# Altium schematic sheet 3PhaseMotorDriver.SchDoc
size A1
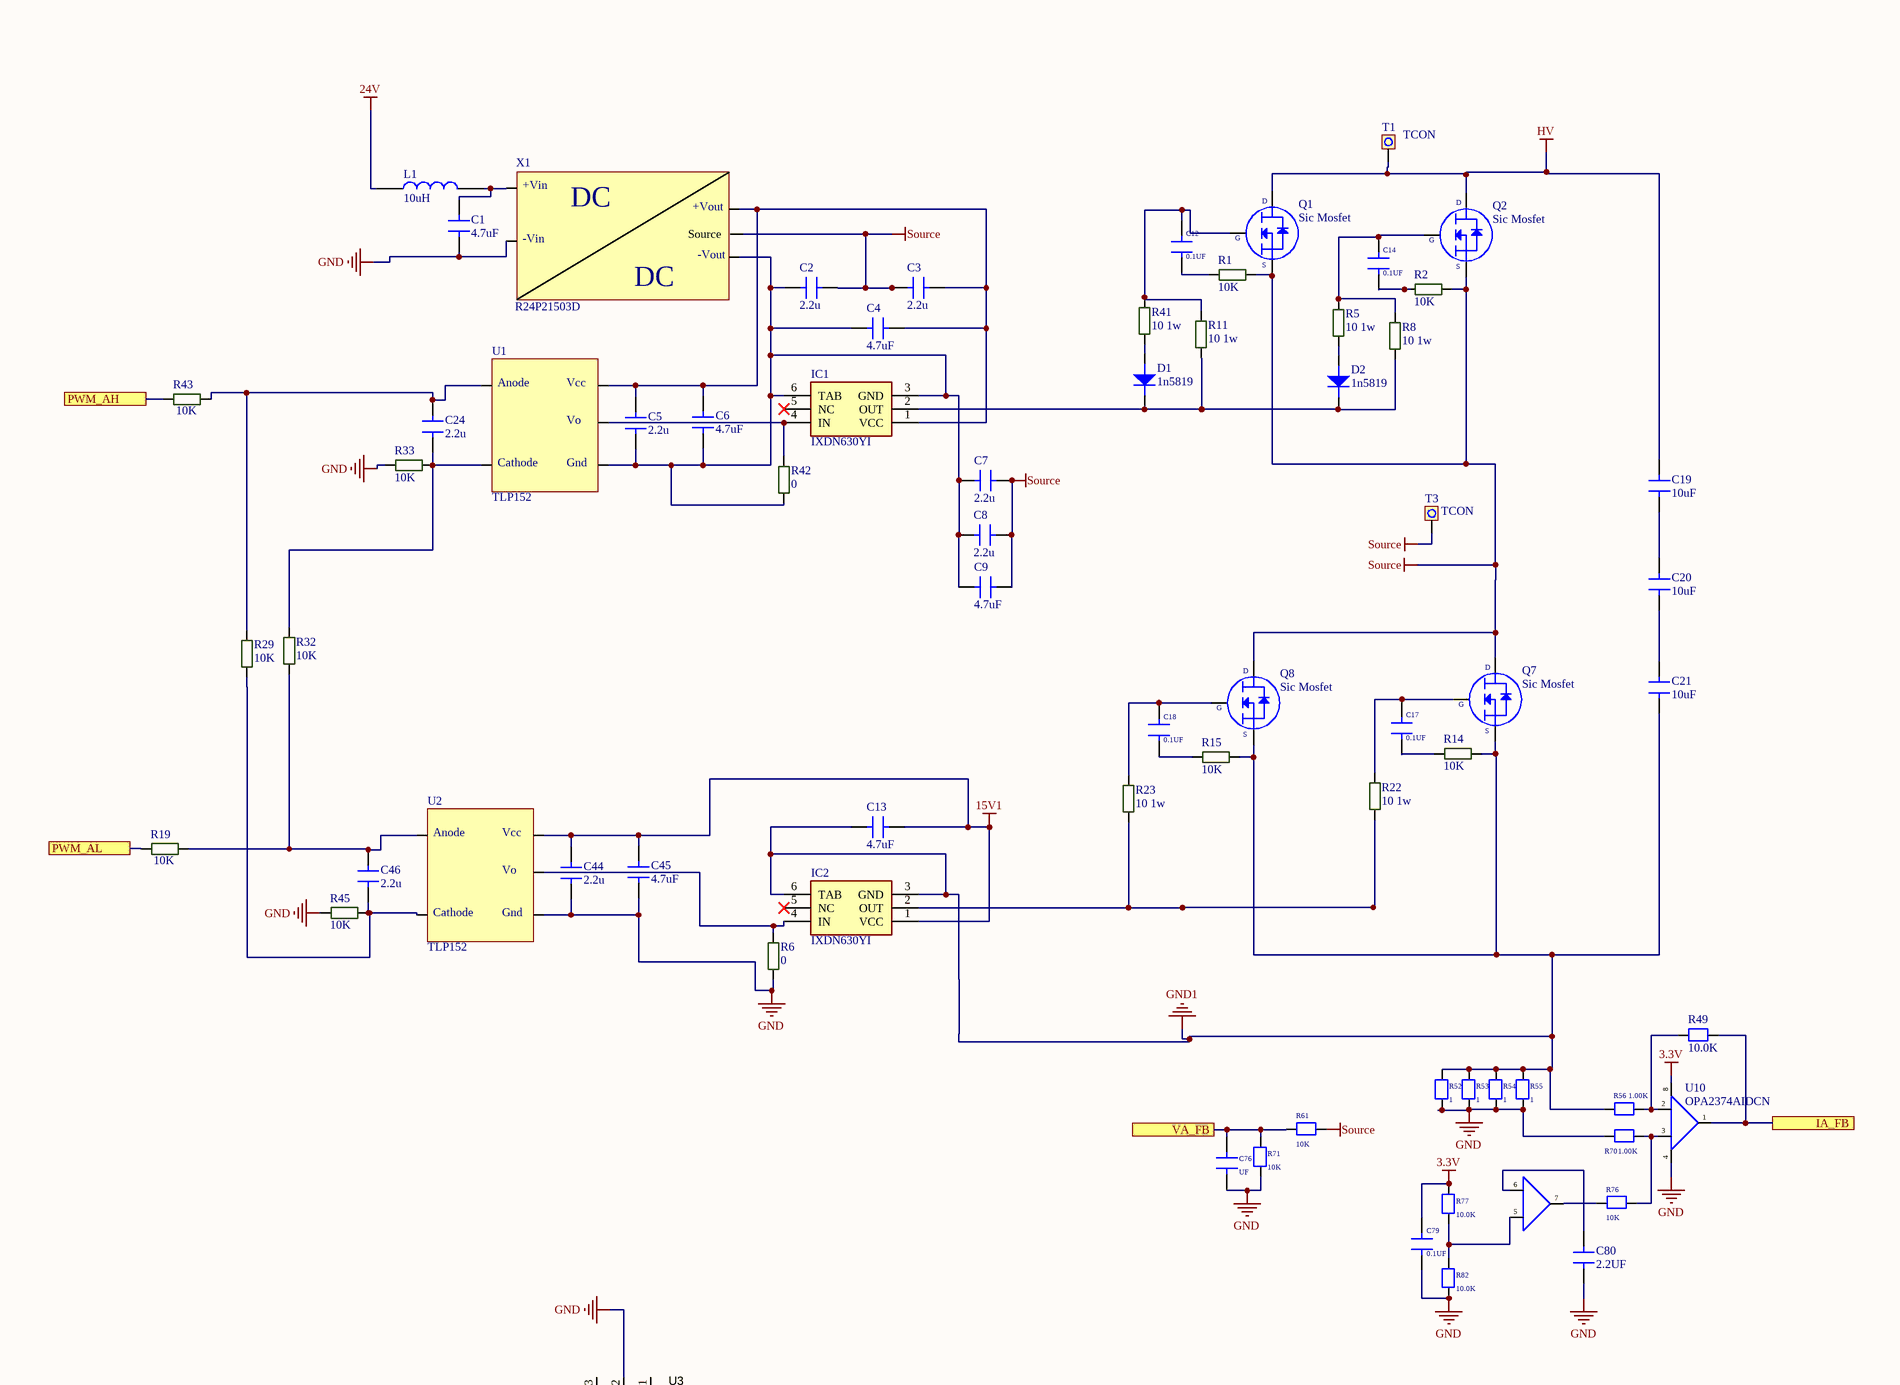
[diagram p0: 3PhaseMotorDriver.SchDoc, top left]
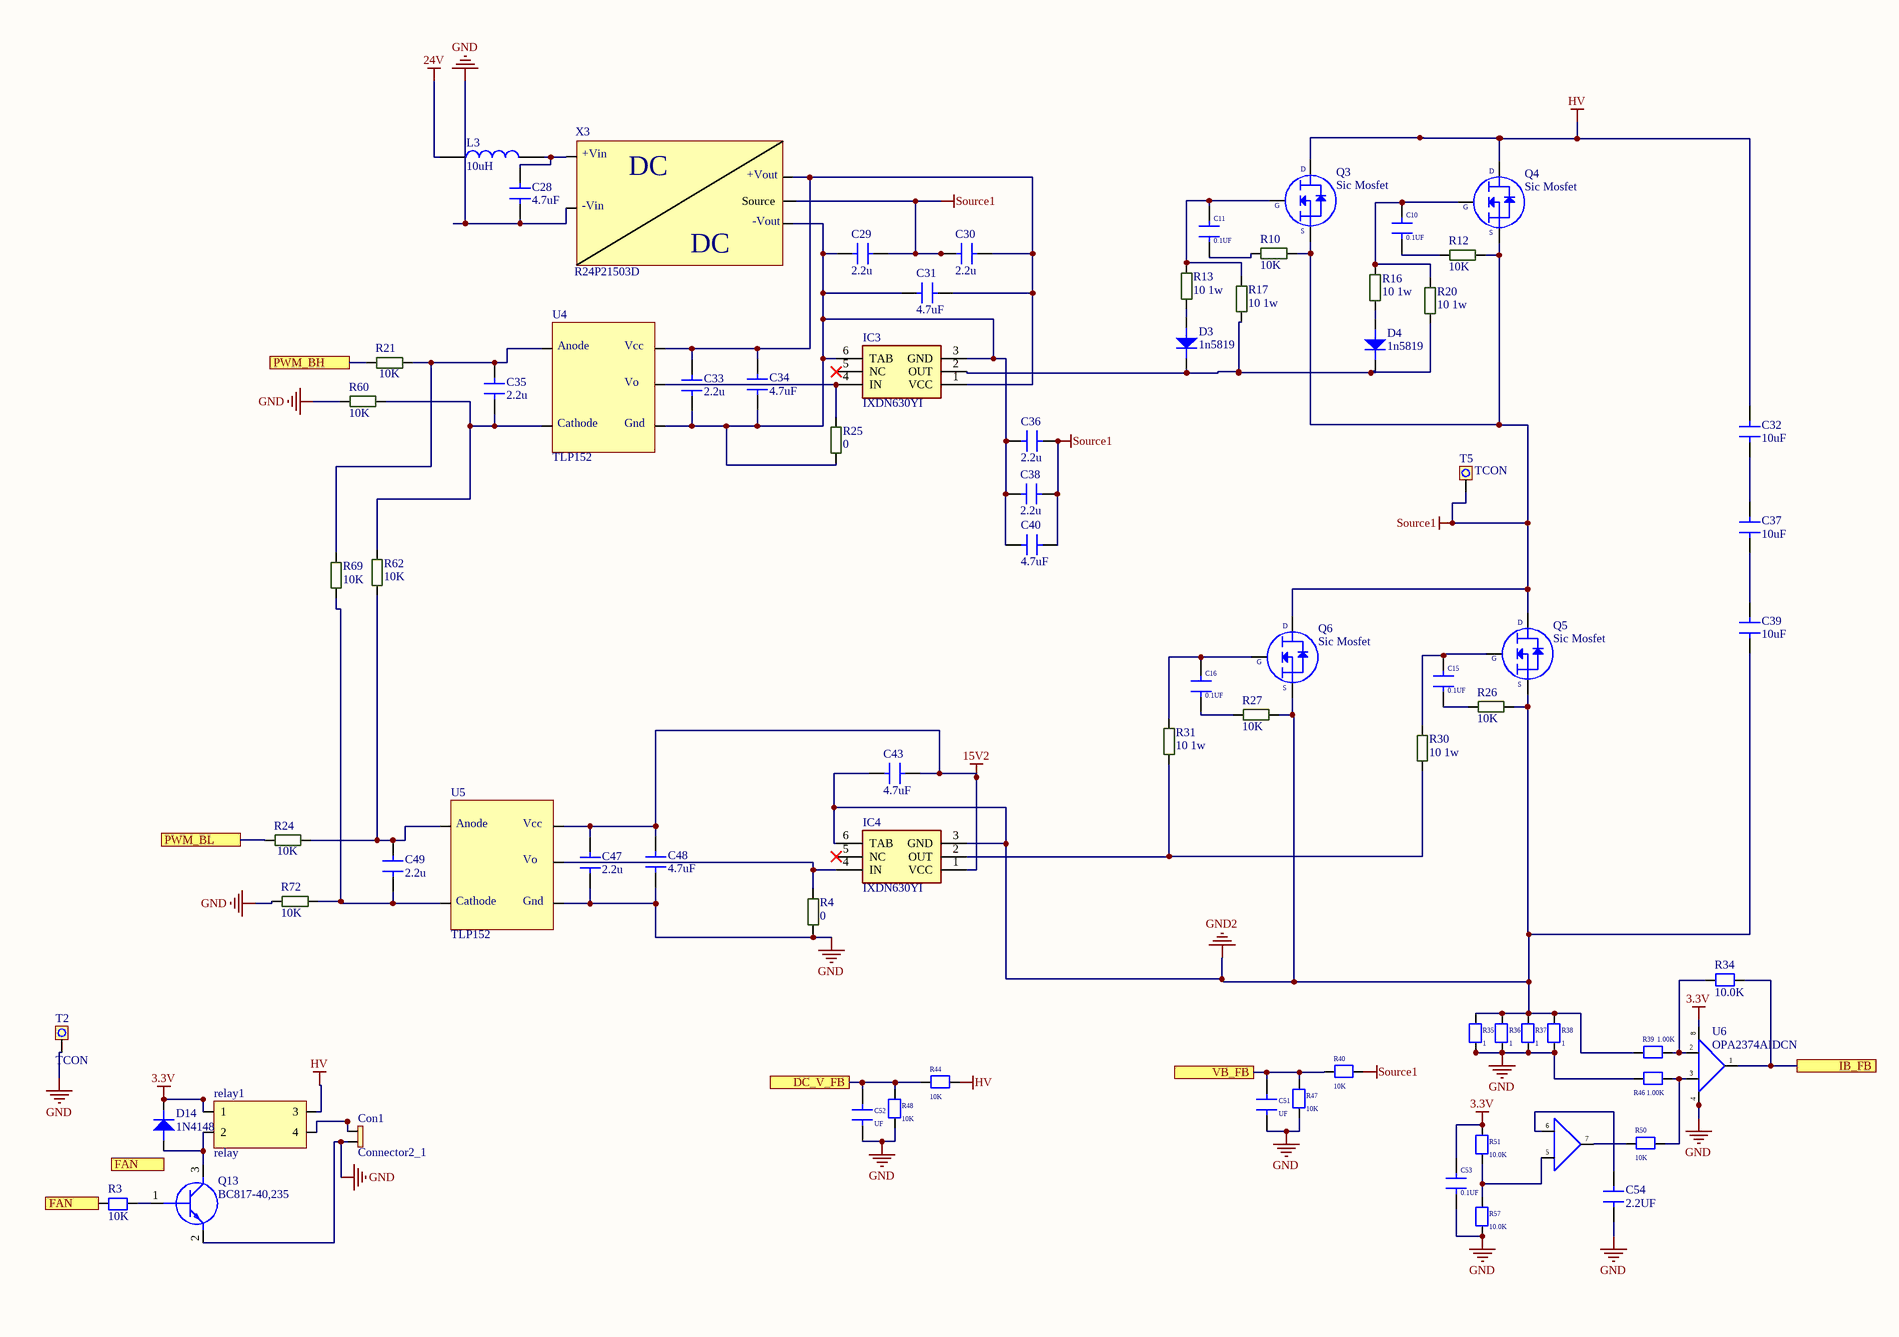
[diagram p1: 3PhaseMotorDriver.SchDoc, top middle]
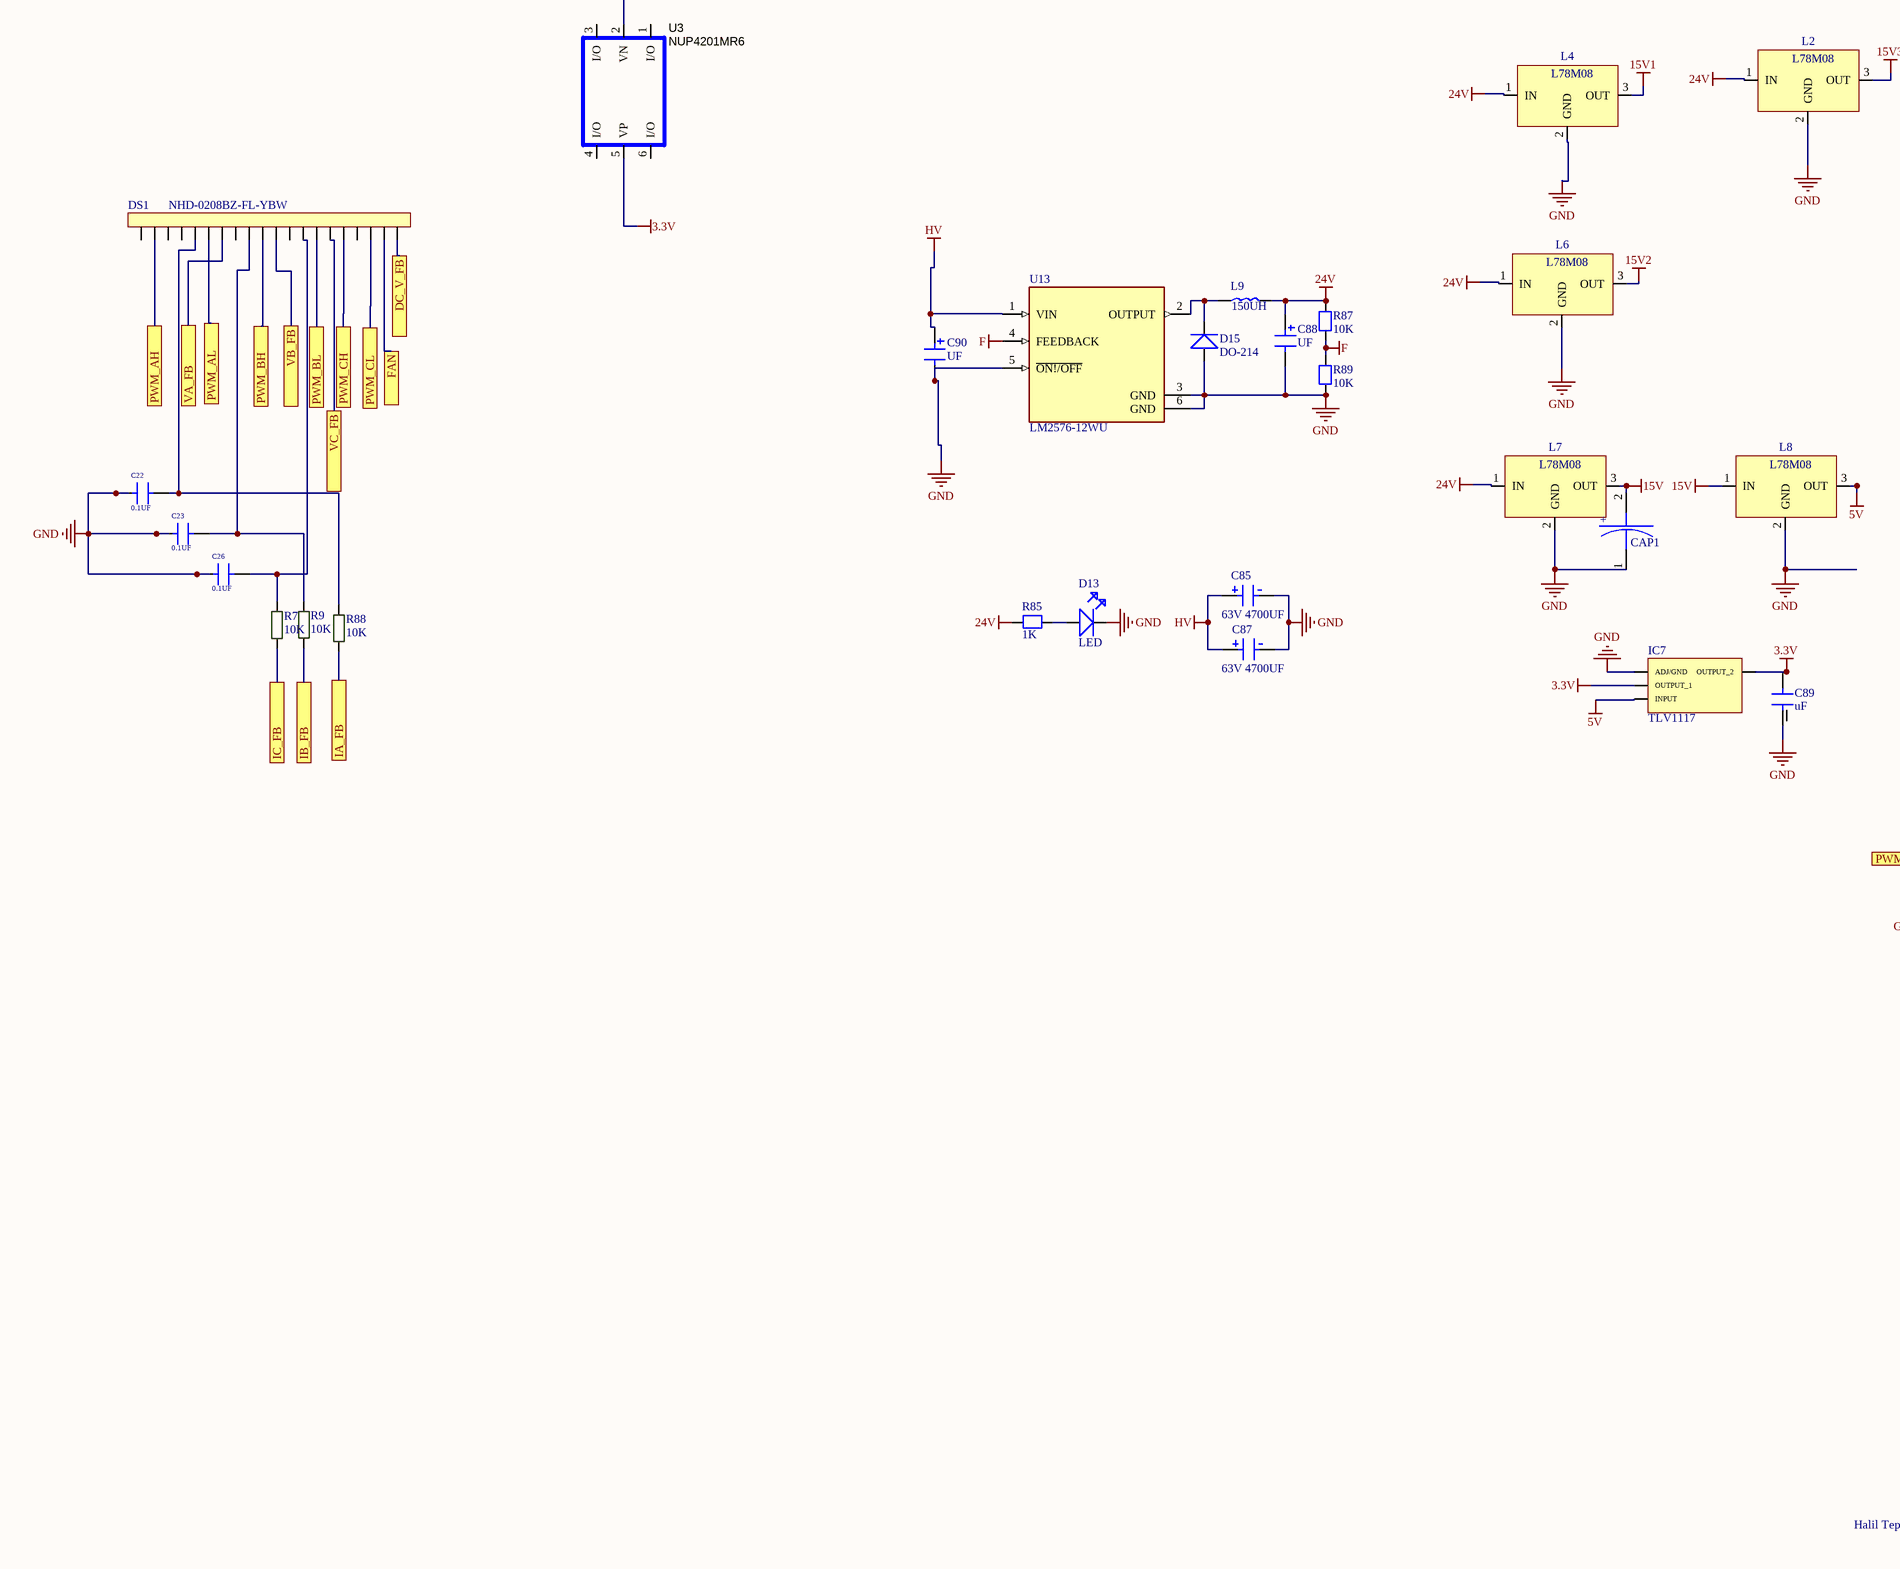
[diagram p2: 3PhaseMotorDriver.SchDoc, bottom left]
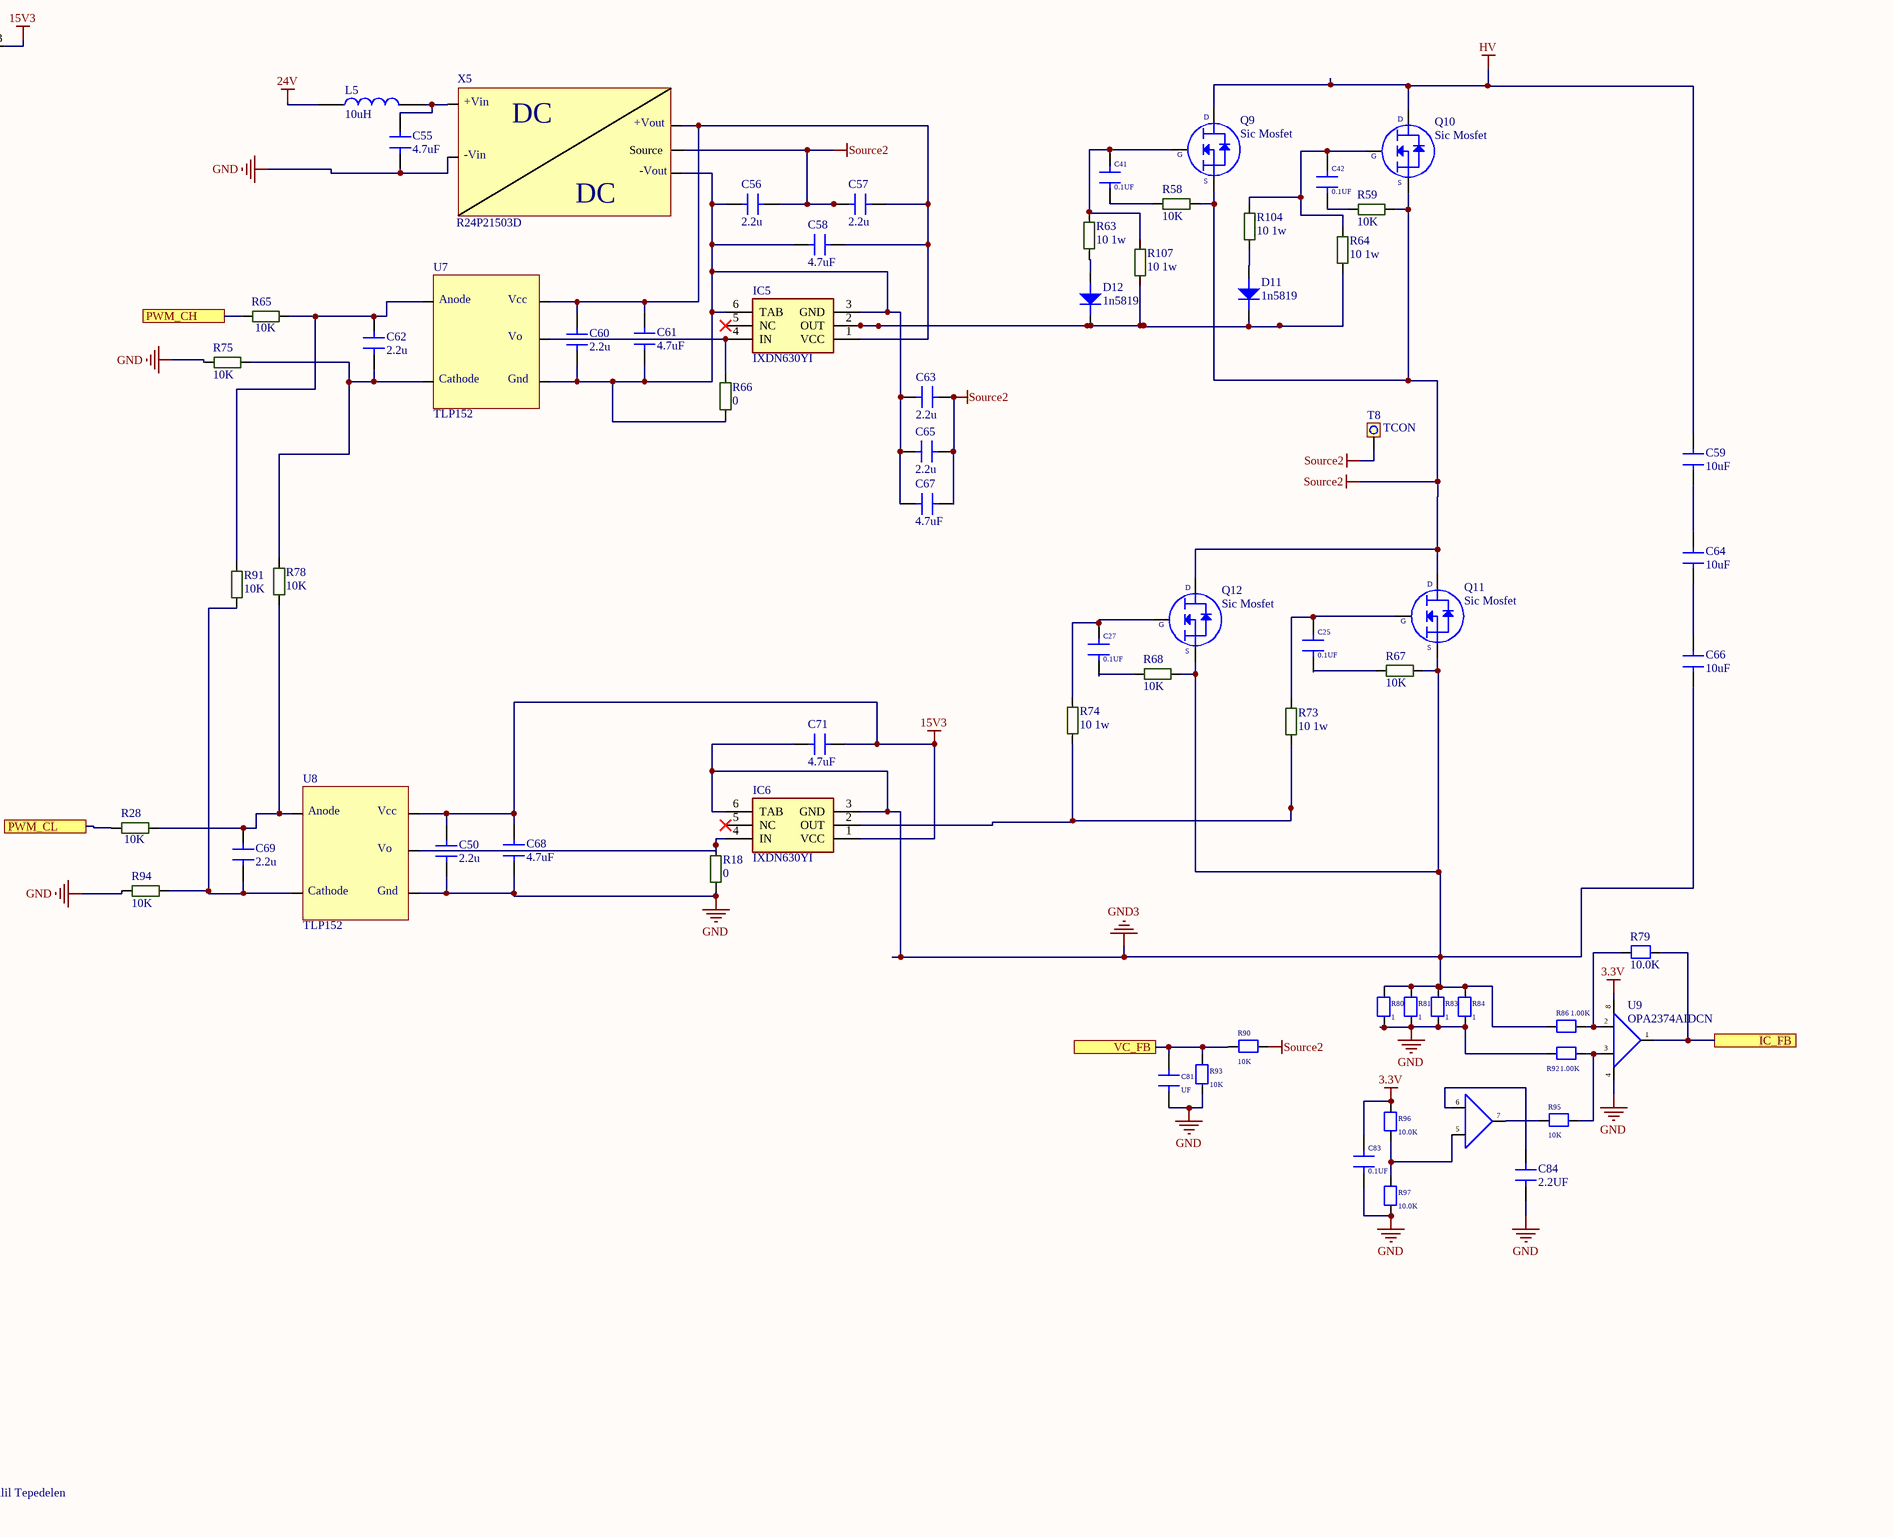
[diagram p3: 3PhaseMotorDriver.SchDoc, bottom middle]
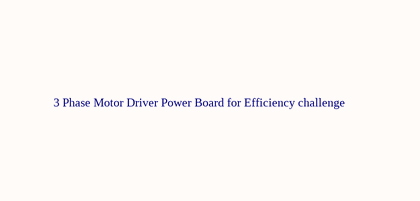
[diagram p4: 3PhaseMotorDriver.SchDoc, bottom right]

## Parts
C1  4.7uF  [C-1206]
C2  2.2u  [C-0805]
C3  2.2u  [C-0805]
C4  4.7uF  [C-1206]
C5  2.2u  [C-0805]
C6  4.7uF  [C-1206]
C7  2.2u  [C-0805]
C8  2.2u  [C-0805]
C9  4.7uF  [C-1206]
C10  0.1UF  [C-0603W]
C11  0.1UF  [C-0603W]
C12  0.1UF  [C-0603W]
C13  4.7uF  [C-1206]
C14  0.1UF  [C-0603W]
C15  0.1UF  [C-0603W]
C16  0.1UF  [C-0603W]
C17  0.1UF  [C-0603W]
C18  0.1UF  [C-0603W]
C19  10uF  [C-2220R]
C20  10uF  [C-2220R]
C21  10uF  [C-2220R]
C22  0.1UF  [C-0603W]
C23  0.1UF  [C-0603W]
C24  2.2u  [C-0805]
C25  0.1UF  [C-0603W]
C26  0.1UF  [C-0603W]
C27  0.1UF  [C-0603W]
C28  4.7uF  [C-1206]
C29  2.2u  [C-0805]
C30  2.2u  [C-0805]
C31  4.7uF  [C-1206]
C32  10uF  [C-2220R]
C33  2.2u  [C-0805]
C34  4.7uF  [C-1206]
C35  2.2u  [C-0805]
C36  2.2u  [C-0805]
C37  10uF  [C-2220R]
C38  2.2u  [C-0805]
C39  10uF  [C-2220R]
C40  4.7uF  [C-1206]
C41  0.1UF  [C-0603W]
C42  0.1UF  [C-0603W]
C43  4.7uF  [C-1206]
C44  2.2u  [C-0805]
C45  4.7uF  [C-1206]
C46  2.2u  [C-0805]
C47  2.2u  [C-0805]
C48  4.7uF  [C-1206]
C49  2.2u  [C-0805]
C50  2.2u  [C-0805]
C51  UF  [C-1206W]
C52  UF  [C-1206W]
C53  0.1UF  [C-0603W]
C54  2.2UF  [C-0603W]
C55  4.7uF  [C-1206]
C56  2.2u  [C-0805]
C57  2.2u  [C-0805]
C58  4.7uF  [C-1206]
C59  10uF  [C-2220R]
C60  2.2u  [C-0805]
C61  4.7uF  [C-1206]
C62  2.2u  [C-0805]
C63  2.2u  [C-0805]
C64  10uF  [C-2220R]
C65  2.2u  [C-0805]
C66  10uF  [C-2220R]
C67  4.7uF  [C-1206]
C68  4.7uF  [C-1206]
C69  2.2u  [C-0805]
C71  4.7uF  [C-1206]
C76  UF  [C-1206W]
C79  0.1UF  [C-0603W]
C80  2.2UF  [C-0603W]
C81  UF  [C-1206W]
C83  0.1UF  [C-0603W]
C84  2.2UF  [C-0603W]
C85  63V 4700UF  [Koshin 63v 4700 cap]
C87  63V 4700UF  [Koshin 63v 4700 cap]
C88  UF  [CapSmdElc]
C89  uF  [CapSmdElc]
C90  UF  [CapSmdElc]
CAP1  VZH100M1HTR-0606  [EEH-ZA1E101XP]  (value not drawn)
Con1  Connector2_1  [2pinCon]
D1  1n5819  [SOD123]
D2  1n5819  [SOD123]
D3  1n5819  [SOD123]
D4  1n5819  [SOD123]
D11  1n5819  [SOD123]
D12  1n5819  [SOD123]
D13  LED  [3.5X2.8X1.9 LED SMD]
D14  1N4148  [SOD123]
D15  DO-214  [DO-214AC]
DS1  NHD-0208BZ-FL-YBW  [idc20]
IC1  IXDN630YI  [5-LEAD_TO-263]
IC2  IXDN630YI  [5-LEAD_TO-263]
IC3  IXDN630YI  [5-LEAD_TO-263]
IC4  IXDN630YI  [5-LEAD_TO-263]
IC5  IXDN630YI  [5-LEAD_TO-263]
IC6  IXDN630YI  [5-LEAD_TO-263]
IC7  TLV1117  [TLV1117]
L1  10uH  [WE-TPC_282892]
L2  l78M08  [L7805]  (value not drawn)
L3  10uH  [WE-TPC_282892]
L4  l78M08  [L7805]  (value not drawn)
L5  10uH  [WE-TPC_282892]
L6  l78M08  [L7805]  (value not drawn)
L7  l78M08  [L7805]  (value not drawn)
L8  l78M08  [L7805]  (value not drawn)
L9  150UH  [IND_B1047AS-151M=P3]
Q1  Sic Mosfet  [247]
Q2  Sic Mosfet  [247]
Q3  Sic Mosfet  [247]
Q4  Sic Mosfet  [247]
Q5  Sic Mosfet  [247]
Q6  Sic Mosfet  [247]
Q7  Sic Mosfet  [247]
Q8  Sic Mosfet  [247]
Q9  Sic Mosfet  [247]
Q10  Sic Mosfet  [247]
Q11  Sic Mosfet  [247]
Q12  Sic Mosfet  [247]
Q13  BC817-40,235  [SOT95P230X110-3N]
R1  10K  [R-1206]
R2  10K  [R-1206]
R3  10K  [R-1206]
R4  0  [R-0805]
R5  10 1w  [R-2512W]
R6  0  [R-0805]
R7  10K  [R-1206]
R8  10 1w  [R-2512W]
R9  10K  [R-1206]
R10  10K  [R-1206]
R11  10 1w  [R-2512W]
R12  10K  [R-1206]
R13  10 1w  [R-2512W]
R14  10K  [R-1206]
R15  10K  [R-1206]
R16  10 1w  [R-2512W]
R17  10 1w  [R-2512W]
R18  0  [R-0805]
R19  10K  [R-1206]
R20  10 1w  [R-2512W]
R21  10K  [R-1206]
R22  10 1w  [R-2512W]
R23  10 1w  [R-2512W]
R24  10K  [R-1206]
R25  0  [R-0805]
R26  10K  [R-1206]
R27  10K  [R-1206]
R28  10K  [R-1206]
R29  10K  [R-1206]
R30  10 1w  [R-2512W]
R31  10 1w  [R-2512W]
R32  10K  [R-1206]
R33  10K  [R-1206]
R34  10.0K  [R-0603W]
R35  1  [R-2512W]
R36  1  [R-2512W]
R37  1  [R-2512W]
R38  1  [R-2512W]
R39  1.00K  [R-0603W]
R40  10K  [R-1206]
R41  10 1w  [R-2512W]
R42  0  [R-0805]
R43  10K  [R-1206]
R44  10K  [R-1206]
R45  10K  [R-1206]
R46  1.00K  [R-0603W]
R47  10K  [R-1206]
R48  10K  [R-1206]
R49  10.0K  [R-0603W]
R50  10K  [R-0603W]
R51  10.0K  [R-0603W]
R52  1  [R-2512W]
R53  1  [R-2512W]
R54  1  [R-2512W]
R55  1  [R-2512W]
R56  1.00K  [R-0603W]
R57  10.0K  [R-0603W]
R58  10K  [R-1206]
R59  10K  [R-1206]
R60  10K  [R-1206]
R61  10K  [R-1206]
R62  10K  [R-1206]
R63  10 1w  [R-2512W]
R64  10 1w  [R-2512W]
R65  10K  [R-1206]
R66  0  [R-0805]
R67  10K  [R-1206]
R68  10K  [R-1206]
R69  10K  [R-1206]
R70  1.00K  [R-0603W]
R71  10K  [R-1206]
R72  10K  [R-1206]
R73  10 1w  [R-2512W]
R74  10 1w  [R-2512W]
R75  10K  [R-1206]
R76  10K  [R-0603W]
R77  10.0K  [R-0603W]
R78  10K  [R-1206]
R79  10.0K  [R-0603W]
R80  1  [R-2512W]
R81  1  [R-2512W]
R82  10.0K  [R-0603W]
R83  1  [R-2512W]
R84  1  [R-2512W]
R85  1K  [14-1210]
R86  1.00K  [R-0603W]
R87  10K  [R-1206]
R88  10K  [R-1206]
R89  10K  [R-1206]
R90  10K  [R-1206]
R91  10K  [R-1206]
R92  1.00K  [R-0603W]
R93  10K  [R-1206]
R94  10K  [R-1206]
R95  10K  [R-0603W]
R96  10.0K  [R-0603W]
R97  10.0K  [R-0603W]
R104  10 1w  [R-2512W]
R107  10 1w  [R-2512W]
relay1  relay  [Relay]
T1  TCON  [tCon]
T2  TCON  [tCon]
T3  TCON  [tCon]
T5  TCON  [tCon]
T8  TCON  [tCon]
U1  TLP152  [TLP152]
U2  TLP152  [TLP152]
U3  NUP4201MR6  [SOT23-6]
U4  TLP152  [TLP152]
U5  TLP152  [TLP152]
U6  OPA2374AIDCN  [FAN3122 Soic8 - duplicate]
U7  TLP152  [TLP152]
U8  TLP152  [TLP152]
U9  OPA2374AIDCN  [FAN3122 Soic8 - duplicate]
U10  OPA2374AIDCN  [FAN3122 Soic8 - duplicate]
U13  LM2576-12WU  [TO17P1435X465-6N]
X1  R24P21503D  [SIP7]
X3  R24P21503D  [SIP7]
X5  R24P21503D  [SIP7]

## Ports
DC_V_FB, FAN, IA_FB, IB_FB, IC_FB, PWM_AH, PWM_AL, PWM_BH, PWM_BL, PWM_CH, PWM_CL, VA_FB, VB_FB, VC_FB

## Nets
3.3V: C53.2 C79.2 C83.2 C89.1 D14.k IC7.2(OUTPUT_1) R51.2 R77.2 R96.2 relay1.1 U3.5(VP) U6.8 U9.8 U10.8
5V: IC7.3(INPUT) L8.3(OUT)
15V: CAP1.2(+) L7.3(OUT) L8.1(IN)
15V1: C13.2 C44.2 C45.2 IC2.1(VCC) L4.3(OUT) U2.5
15V2: C43.2 C47.2 C48.2 IC4.1(VCC) L6.3(OUT) U5.5
15V3: C50.2 C68.2 C71.2 IC6.1(VCC) L2.3(OUT) U8.5
24V: C88.1 L1.1 L2.1(IN) L3.1 L4.1(IN) L5.1 L6.1(IN) L7.1(IN) L9.2 R85.1 R87.2
F: R87.1 R89.2 U13.4(FEEDBACK)
GND: C1.1 C22.1 C23.1 C26.1 C28.1 C44.1 C45.1 C47.1 C48.1 C50.1 C51.1 C52.1 C53.1 C54.1 C55.1 C68.1 C76.1 C79.1 C80.1 C81.1 C83.1 C84.1 C85.2 C87.2 C88.2 C89.2 C90.2 CAP1.1 Con1.2 D13.2 D15.a IC7.1(ADJ/GND) L2.2(GND) L4.2(GND) L6.2(GND) L7.2(GND) L8.2(GND) Q13.2(E) R4.1 R6.1 R18.1 R33.1 R35.1 R36.1 R37.1 R38.1 R45.1 R46.1 R47.1 R48.1 R52.1 R53.1 R54.1 R55.1 R57.1 R60.1 R70.1 R71.1 R72.1 R75.1 R80.1 R81.1 R82.1 R83.1 R84.1 R89.1 R92.1 R93.1 R94.1 R97.1 T2.1 U2.3 U3.2(VN) U5.3 U6.4 U8.3 U9.4 U10.4 U13.3(GND) U13.5(~{ON!/OFF}) U13.6(GND) X1.2 X3.2 X5.2
GND1: C13.1 C21.1 IC2.3(GND) IC2.6(TAB) Q7.3 Q8.3 R14.2 R15.2 R52.2 R53.2 R54.2 R55.2 R56.1
GND2: C39.1 C43.1 IC4.3(GND) IC4.6(TAB) Q5.3 Q6.3 R26.2 R27.2 R35.2 R36.2 R37.2 R38.2 R39.1
GND3: C66.1 C71.1 IC6.3(GND) IC6.6(TAB) Q11.3 Q12.3 R67.2 R68.2 R80.2 R81.2 R83.2 R84.2 R86.1
HV: C19.2 C32.2 C59.2 C85.1 C87.1 C90.1 Q1.2 Q2.2 Q3.2 Q4.2 Q9.2 Q10.2 R44.2 relay1.3 T1.1 U13.1(VIN)
Source: C2.1 C3.2 C7.2 C8.2 C9.2 Q1.3 Q2.3 Q7.2 Q8.2 R1.2 R2.2 R61.2 T3.1 X1.6(Source)
Source1: C29.1 C30.2 C36.2 C38.2 C40.2 Q3.3 Q4.3 Q5.2 Q6.2 R10.2 R12.2 R40.2 T5.1 X3.6(Source)
Source2: C56.1 C57.2 C63.2 C65.2 C67.2 Q9.3 Q10.3 Q11.2 Q12.2 R58.2 R59.2 R90.2 T8.1 X5.6(Source)
DC_V_FB: C52.2 DS1.20 R44.1 R48.2 ; port DC_V_FB
FAN: DS1.19 R3.2 ; port FAN
IA_FB: R49.2 R88.1 U10.1 ; port IA_FB
IB_FB: R9.1 R34.2 U6.1 ; port IB_FB
IC_FB: R7.1 R79.2 U9.1 ; port IC_FB
PWM_AH: DS1.2 R43.2 ; port PWM_AH
PWM_AL: DS1.6 R19.2 ; port PWM_AL
PWM_BH: DS1.10 R21.2 ; port PWM_BH
PWM_BL: DS1.14 R24.2 ; port PWM_BL
PWM_CH: DS1.16 R65.2 ; port PWM_CH
PWM_CL: DS1.18 R28.2 ; port PWM_CL
VA_FB: C76.2 DS1.7 R61.1 R71.2 ; port VA_FB
VB_FB: C51.2 DS1.11 R40.1 R47.2 ; port VB_FB
VC_FB: C81.2 DS1.15 R90.1 R93.2 ; port VC_FB
NetC1_2: C1.2 L1.2 X1.1
NetC2_2: C2.2 C4.1 C5.1 C6.1 C7.1 C8.1 C9.1 IC1.3(GND) IC1.6(TAB) R42.1 U1.3 X1.5
NetC3_1: C3.1 C4.2 C5.2 C6.2 IC1.1(VCC) U1.5 X1.7
NetC10_1: C10.1 R12.1
NetC10_2: C10.2 Q4.1 R16.1 R20.2
NetC11_1: C11.1 R10.1
NetC11_2: C11.2 Q3.1 R13.1 R17.2
NetC12_1: C12.1 R1.1
NetC12_2: C12.2 Q1.1 R11.2 R41.1
NetC14_1: C14.1 R2.1
NetC14_2: C14.2 Q2.1 R5.1 R8.2
NetC15_1: C15.1 R26.1
NetC15_2: C15.2 Q5.1 R30.2
NetC16_1: C16.1 R27.1
NetC16_2: C16.2 Q6.1 R31.2
NetC17_1: C17.1 R14.1
NetC17_2: C17.2 Q7.1 R22.2
NetC18_1: C18.1 R15.1
NetC18_2: C18.2 Q8.1 R23.2
NetC19_1: C19.1 C20.2
NetC20_1: C20.1 C21.2
NetC22_2: C22.2 DS1.5 R88.2
NetC23_2: C23.2 DS1.9 R9.2
NetC24_1: C24.1 R32.1 R33.2 U1.2
NetC24_2: C24.2 R29.1 R43.1 U1.1
NetC25_1: C25.1 R67.1
NetC25_2: C25.2 Q11.1 R73.2
NetC26_2: C26.2 DS1.13 R7.2
NetC27_1: C27.1 R68.1
NetC27_2: C27.2 Q12.1 R74.2
NetC28_2: C28.2 L3.2 X3.1
NetC29_2: C29.2 C31.1 C33.1 C34.1 C36.1 C38.1 C40.1 IC3.3(GND) IC3.6(TAB) R25.1 U4.3 X3.5
NetC30_1: C30.1 C31.2 C33.2 C34.2 IC3.1(VCC) U4.5 X3.7
NetC32_1: C32.1 C37.2
NetC35_1: C35.1 R60.2 R62.1 U4.2
NetC35_2: C35.2 R21.1 R69.1 U4.1
NetC37_1: C37.1 C39.2
NetC41_1: C41.1 R58.1
NetC41_2: C41.2 Q9.1 R63.2 R107.1
NetC42_1: C42.1 R59.1
NetC42_2: C42.2 Q10.1 R64.2 R104.2
NetC46_1: C46.1 R29.2 R45.2 U2.2
NetC46_2: C46.2 R19.1 R32.2 U2.1
NetC49_1: C49.1 R69.2 R72.2 U5.2
NetC49_2: C49.2 R24.1 R62.2 U5.1
NetC54_2: C54.2 U6.6
NetC55_2: C55.2 L5.2 X5.1
NetC56_2: C56.2 C58.1 C60.1 C61.1 C63.1 C65.1 C67.1 IC5.3(GND) IC5.6(TAB) R66.1 U7.3 X5.5
NetC57_1: C57.1 C58.2 C60.2 C61.2 IC5.1(VCC) U7.5 X5.7
NetC59_1: C59.1 C64.2
NetC62_1: C62.1 R75.2 R78.1 U7.2
NetC62_2: C62.2 R65.1 R91.1 U7.1
NetC64_1: C64.1 C66.2
NetC69_1: C69.1 R91.2 R94.2 U8.2
NetC69_2: C69.2 R28.1 R78.2 U8.1
NetC80_2: C80.2 U10.6
NetC84_2: C84.2 U9.6
NetCon1_1: Con1.1 relay1.4
NetD1_a: D1.a R41.2
NetD1_k: D1.k D2.k IC1.2(OUT) R8.1 R11.1
NetD2_a: D2.a R5.2
NetD3_a: D3.a R13.2
NetD3_k: D3.k D4.k IC3.2(OUT) R17.1 R20.1
NetD4_a: D4.a R16.2
NetD11_a: D11.a R104.1
NetD11_k: D11.k D12.k IC5.2(OUT) R64.1 R107.2
NetD12_a: D12.a R63.1
NetD13_1: D13.1 R85.2
NetD14_a: D14.a Q13.3(C) relay1.2
NetD15_k: D15.k L9.1 U13.2(OUTPUT)
NetIC1_4: IC1.4(IN) R42.2 U1.4
NetIC2_2: IC2.2(OUT) R22.1 R23.1
NetIC2_4: IC2.4(IN) R6.2 U2.4
NetIC3_4: IC3.4(IN) R25.2 U4.4
NetIC4_2: IC4.2(OUT) R30.1 R31.1
NetIC4_4: IC4.4(IN) R4.2 U5.4
NetIC5_4: IC5.4(IN) R66.2 U7.4
NetIC6_2: IC6.2(OUT) R73.1 R74.1
NetIC6_4: IC6.4(IN) R18.2 U8.4
NetQ13_1: Q13.1(B) R3.1
NetR34_1: R34.1 R39.2 U6.2
NetR46_2: R46.2 R50.2 U6.3
NetR49_1: R49.1 R56.2 U10.2
NetR50_1: R50.1 U6.7
NetR51_1: R51.1 R57.2 U6.5
NetR70_2: R70.2 R76.2 U10.3
NetR76_1: R76.1 U10.7
NetR77_1: R77.1 R82.2 U10.5
NetR79_1: R79.1 R86.2 U9.2
NetR92_2: R92.2 R95.2 U9.3
NetR95_1: R95.1 U9.7
NetR96_1: R96.1 R97.2 U9.5

Not connected (* = marked no-connect by the designer): DS1 1 3 4 8 12 17; IC1 5(NC)*; IC2 5(NC)*; IC3 5(NC)*; IC4 5(NC)*; IC5 5(NC)*; IC6 5(NC)*; U3 1(I/O) 3(I/O) 4(I/O) 6(I/O)

## Notes on the sheet
- 3 Phase Motor Driver Power Board for Efficiency challenge
- Halil Tepedelen
- (in symbol l78M08) L78M08
- (in symbol R24P21503D) +Vin; DC; +Vout; -Vin; -Vout
- (in symbol Sic Mosfet To247) D; G; S
- (in symbol TLP152(TPL,E) Anode; Vcc; Vo; Cathode; Gnd

## Library data of the parts
C1 C4 C6 C9 C13 C28 C31 C34 C40 C43 C45 C48 C55 C58 C61 C67 C68 C71 = C-1206: MLCC (3216) 1206 4.7uF 50VDC ±10% X7R; Özdisan Part Number: CL31B475KBHNNNE; Manufacturer: SAMSUNG; Link: https://www.ozdisan.com/pasif-komponentler/kondansatorler/smd-kondansatorler-mlcc/CL31B475KBHNNNE; Price: 0,10407
C2 C3 C5 C7 C8 C24 C29 C30 C33 C35 C36 C38 C44 C46 C47 C49 C50 C56 C57 C60 C62 C63 C65 C69 = C-0805: MLCC (2012) 0805 2.2uF 50VDC ±10% X5R; Manufacturer: SAMSUNG; Özdisan Part Number: CL21A225KBQNNNE; Price: 0,04880; Link: https://www.ozdisan.com/pasif-komponentler/kondansatorler/smd-kondansatorler-mlcc/CL21A225KBQNNNE
C10-C12 C14-C18 C22 C23 C25-C27 C41 C42 C53 C79 C83 = CAPACITOR 0.1UF: 0603
C19-C21 C32 C37 C39 C59 C64 C66 = Cap2220: 2220; Özdisan Part Number: CL31B475KBHNNNE; Manufacturer: SAMSUNG; Link: https://www.ozdisan.com/pasif-komponentler/kondansatorler/smd-kondansatorler-mlcc/CL31B475KBHNNNE; Price: 0,10407
C51 C52 C76 C81 = CAPACITOR
C54 C80 C84 = CAPACITOR 2.2UF: 0603
C85 C87 = CAPACITOR 4700UF
C88 C90 = CAPCITOR UF: ALUMİNUM ELECTROLYTIC CAPACITOR
C89 = CAPSMDELC
CAP1 = EEH-ZA1E101XP: Supplier 1: Mouser; Supplier Part Number 1: 667-EEH-ZA1E101XP
D1-D4 D11 D12 = 1N4148W-E3-18: DIODE SCHOTTKY 1A 40V SOD123; Manufacturer: HOTTECH; Özdisan Part Number: B5819W; ComponentLink1URL: https://datasheet.ciiva.com/29885/1n4148w-29885941.pdf?src-supplier=Avnet; ComponentLink1Description: https://datasheet.ciiva.com/29885/1n4148w-29885941.pdf?src-supplier=Avnet; ComponentLink2URL: https://datasheet.ciiva.com/29593/1n4148w-29593113.pdf?src-supplier=Digi-Key; ComponentLink2Description: https://datasheet.ciiva.com/29593/1n4148w-29593113.pdf?src-supplier=Digi-Key; ComponentLink3URL: https://datasheet.ciiva.com/29593/1n4148w-29593111.pdf?src-supplier=Digi-Key; ComponentLink3Description: https://datasheet.ciiva.com/29593/1n4148w-29593111.pdf?src-supplier=Digi-Key; ComponentLink4URL: https://datasheet.ciiva.com/29593/1n4148w-29593112.pdf?src-supplier=Digi-Key; ComponentLink4Description: https://datasheet.ciiva.com/29593/1n4148w-29593112.pdf?src-supplier=Digi-Key; Link: https://www.ozdisan.com/guc-yari-iletkenleri/diyot-modul-diyot-dogrultucular/schottky-diyotlar/B5819W; Price: 0,04258
D14 = 1N4148: DIODE FAST SWITCHING Single 150mA 75V SMT SOD323
D15 = DO 214
DS1 = IDC-20
IC1-IC6 = IXDN630YI: Integrated Circuit; Manufacturer_Name: IXYS SEMICONDUCTOR; Datasheet Link: https://www.mouser.com/datasheet/2/240/IXD_630-1545995.pdf; Manufacturer_Part_Number: IXDN630YI; Mouser Part Number: 849-IXDN630YI; Mouser Price/Stock: https://www.mouser.co.uk/ProductDetail/IXYS-Integrated-Circuits/IXDN630YI?qs=uhAJVUz%252BE3%2FH75bq1SGVng%3D%3D; Arrow Part Number: IXDN630YI; Arrow Price/Stock: https://www.arrow.com/en/products/ixdn630yi/ixys
L1 L3 L5 = inductor: INDUCTOR POWER 10UH 2.8X2.8X2.8MM SMD; Özdisan Part Number: 744025100; Manufacturer: WURTH; Link: https://www.ozdisan.com/pasif-komponentler/induktorler/sabit-induktor/744025100; Price: 0,74325
Q1-Q12 = Sic Mosfet To247
Q13 = BC817-40,235: Transistor BJT NPN; Manufacturer_Name: Nexperia; Datasheet Link: http://assets.nexperia.com/documents/data-sheet/BC817_BC817W_BC337.pdf; Height: 1.1mm; Manufacturer_Part_Number: BC817-40,235; Mouser Part Number: 771-BC817-40235; Mouser Price/Stock: https://www.mouser.com/Search/Refine.aspx?Keyword=771-BC817-40235; RS Part Number: 1707957; RS Price/Stock: http://uk.rs-online.com/web/p/products/1707957
R1 R2 R7 R9 R10 R12 R14 R15 R19 R21 R24 R26-R29 R32 R33 R43 R45 R58-R60 R62 R65 R67-R69 R72 R75 R78 R88 R91 R94 = R-1206_GS: 1206S4F1002T5E; ComponentLink1Description: link; ComponentLink1URL: https://www.ozdisan.com/pasif-komponentler/direncler/smt-smd-direncler/1206S4F1002T5E
R3 R40 R44 R47 R48 R61 R71 R87 R89 R90 R93 = RESISTOR 10K: 1206
R4 R6 R18 R25 R42 R66 = Res0805: RES.(2012) 0805 0 Ohms 5% 1/8W-S 800PPM; Manufacturer: ROYALOHM; Özdisan Part Number: 0805S8J0000T5E; Link: https://www.ozdisan.com/pasif-komponentler/direncler/smt-smd-direncler/0805S8J0000T5E; Price: 0,00234
R5 R8 R11 R13 R16 R17 R20 R22 R23 R30 R31 R41 R63 R64 R73 R74 R104 R107 = R-2512
R34 R49 R51 R57 R77 R79 R82 R96 R97 = RESISTOR 10.0K: 0603
R35-R38 R52-R55 R80 R81 R83 R84 = RESISTOR 1: 2512
R39 R46 R56 R70 R86 R92 = RESISTOR 1.00K: 0603
R50 R76 R95 = RESISTOR 10K 0603: 0603
R85 = RESISTORR  1K
U1 U2 U4 U5 U7 U8 = TLP152(TPL,E: IC-152 PHOTOCOUPLER GATE DRIVE SO6 TOSHIBA; ComponentLink1URL: https://datasheet.ciiva.com/41848/tlp152-datasheet-en-20120914-41848928.pdf?src-supplier=Digi-Key; ComponentLink1Description: https://datasheet.ciiva.com/41848/tlp152-datasheet-en-20120914-41848928.pdf?src-supplier=Digi-Key; Price: 0,80155; Link: https://www.ozdisan.com/optolar-sensorler/optolar/gate-surucu-optokuplorleri/TLP152TPLE; Özdisan Part Number: TLP152(TPL,E; Manufacturer: TOSHIBA
U3 = NUP4201MR6: IC,  500w 6v, Transient Voltage  Suppressors; Manufacturer: On Semi; Area: 20.1 mm; ComponentHeight: 1 mm; SymbolVersion: 04/10/2012 10:34:18; PartNumber: NUP4201MR6; ComponentLink1URL: \\vette02\pmp_pcb\pcad_pdf's\NUP4201MR6-D.pdf; PackageReference: SOT; Value: NUP4201MR6; ComponentLink1Description: AEO Datasheet Link
X1 X3 X5 = R24P21503D: Manufacturer: Recom; Max Output Voltage: 15V; Supplier 1: Digi-Key; Manufacturer Part Number: R24P21503D; RoHS: No; Stock 1: 378; Pricing 1: 1 = 8.78000, 5 = 8.71200, 10 = 8.64500, 25 = 8.51200, 50 = 8.24600, 100 = 7.44800, 250 = 7.31500, 500 = 7.18200 (USD); Weight: 4.3g; Length: 19.5mm; Height: 12.5mm; Width: 9.8mm; Supplier Part Number 1: 945-3071-5-ND
Con1 = Connector2_1: System: Connector